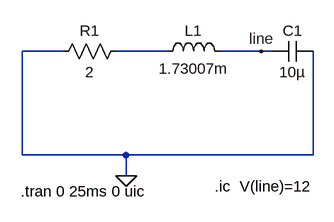
[diagram p0: schematic Aufgabe2.2b.asc]
Aufgabe2.2b.asc, the LTspice schematic file:
Version 4
SHEET 1 880 680
WIRE -16 80 -80 80
WIRE 144 80 64 80
WIRE 288 80 224 80
WIRE 304 80 288 80
WIRE -80 240 -80 80
WIRE 80 240 -80 240
WIRE 368 240 368 80
WIRE 368 240 80 240
WIRE 80 272 80 240
FLAG 80 272 0
FLAG 288 80 line
SYMBOL res -32 96 R270
WINDOW 0 32 56 VTop 2
WINDOW 3 0 56 VBottom 2
SYMATTR InstName R1
SYMATTR Value 2
SYMBOL ind 128 96 R270
WINDOW 0 32 56 VTop 2
WINDOW 3 5 56 VBottom 2
SYMATTR InstName L1
SYMATTR Value 1.73007m
SYMBOL cap 304 96 R270
WINDOW 0 32 32 VTop 2
WINDOW 3 0 32 VBottom 2
SYMATTR InstName C1
SYMATTR Value 10µ
TEXT -82 296 Left 2 !.tran 0 25ms 0 uic
TEXT 216 288 Left 2 !.ic  V(line)=12

The netlist it stands for:
* Aufgabe2.2b.asc
R1 0 N001 2
L1 N001 line 1.73007m
C1 line 0 10µ
.tran 0 25ms 0 uic
.ic  V(line)=12
.backanno
.end